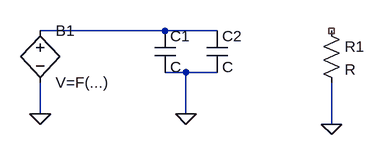
[diagram p0: schematic Sinterizado.asc]
Sinterizado.asc, the LTspice schematic file:
Version 4
SHEET 1 880 680
WIRE 144 96 -48 96
WIRE 224 96 144 96
WIRE 176 160 144 160
WIRE 224 160 176 160
WIRE -48 224 -48 176
WIRE 176 224 176 160
WIRE 400 240 400 176
FLAG 176 224 0
FLAG 400 240 0
FLAG -48 224 0
SYMBOL cap 128 96 R0
SYMATTR InstName C1
SYMBOL cap 208 96 R0
SYMATTR InstName C2
SYMBOL res 384 80 R0
SYMATTR InstName R1
SYMBOL bv -48 80 R0
SYMATTR InstName B1

The netlist it stands for:
* Sinterizado.asc
C1 N001 0 C
C2 N001 0 C
R1 NC_01 0 R
B1 N001 0 V=F(...)
.backanno
.end